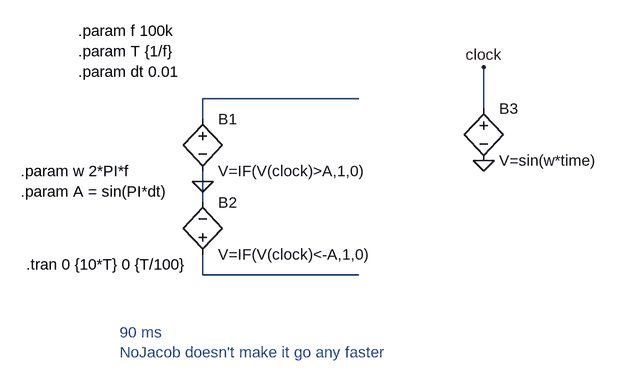
[diagram p0: schematic pwm1.asc]
pwm1.asc, the LTspice schematic file:
Version 4
SHEET 1 1068 988
WIRE 304 96 64 96
WIRE 496 112 496 48
WIRE 64 128 64 96
WIRE 64 224 64 208
WIRE 64 256 64 224
WIRE 64 368 64 336
WIRE 304 368 64 368
FLAG 64 224 0
FLAG 496 192 0
FLAG 496 48 clock
SYMBOL bv 64 112 R0
SYMATTR InstName B1
SYMATTR Value V=IF(V(clock)>A,1,0)
SYMATTR Value2 tripdt={1m*T}
SYMBOL bv 64 352 M180
WINDOW 0 24 96 Left 2
WINDOW 3 24 16 Left 2
SYMATTR InstName B2
SYMATTR Value V=IF(V(clock)<-A,1,0)
SYMATTR Value2 tripdt={1m*T}
SYMBOL bv 496 96 R0
SYMATTR InstName B3
SYMATTR Value V=sin(w*time)
TEXT -128 -8 Left 2 !.param f 100k\n.param T {1/f}\n.param dt 0.01
TEXT -208 352 Left 2 !.tran 0 {10*T} 0 {T/100}
TEXT -64 456 Left 2 ;90 ms\nNoJacob doesn't make it go any faster
TEXT -216 208 Left 2 !.param w 2*PI*f\n.param A = sin(PI*dt)

The netlist it stands for:
* pwm1.asc
B1 N001 0 V=IF(V(clock)>A,1,0) tripdt={1m*T}
B2 N002 0 V=IF(V(clock)<-A,1,0) tripdt={1m*T}
B3 clock 0 V=sin(w*time)
.param f 100k
.param T {1/f}
.param dt 0.01
.tran 0 {10*T} 0 {T/100}
* 90 ms
* NoJacob doesn't make it go any faster
.param w 2*PI*f
.param A = sin(PI*dt)
.backanno
.end